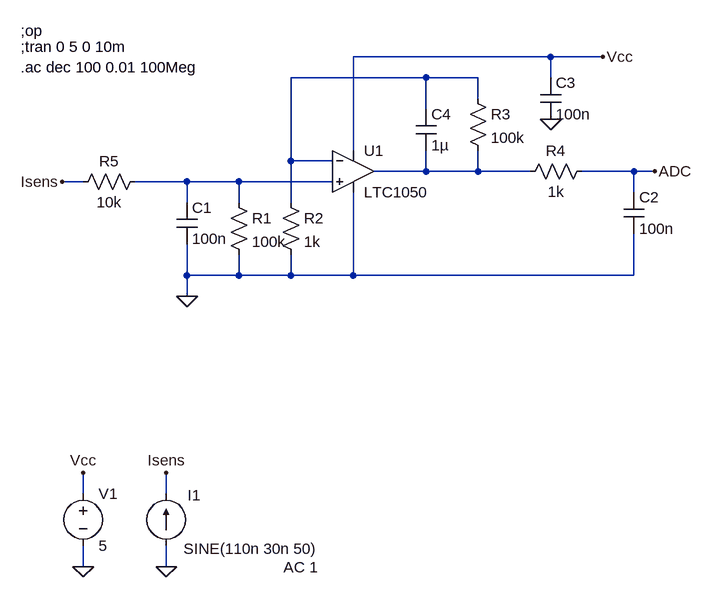
[diagram p0: schematic Ampli.asc]
Ampli.asc, the LTspice schematic file:
Version 4
SHEET 1 880 708
WIRE 464 -96 160 -96
WIRE 544 -96 464 -96
WIRE 272 -64 64 -64
WIRE 352 -64 272 -64
WIRE 464 -64 464 -96
WIRE 352 -32 352 -64
WIRE 272 -16 272 -64
WIRE 160 48 160 -96
WIRE 64 64 64 -64
WIRE 128 64 64 64
WIRE 272 80 272 48
WIRE 272 80 192 80
WIRE 352 80 352 48
WIRE 352 80 272 80
WIRE 432 80 352 80
WIRE 592 80 512 80
WIRE 624 80 592 80
WIRE -256 96 -288 96
WIRE -96 96 -176 96
WIRE -16 96 -96 96
WIRE 128 96 -16 96
WIRE 592 112 592 80
WIRE -96 128 -96 96
WIRE -16 128 -16 96
WIRE 64 128 64 64
WIRE -96 240 -96 192
WIRE -16 240 -16 208
WIRE -16 240 -96 240
WIRE 64 240 64 208
WIRE 64 240 -16 240
WIRE 160 240 160 112
WIRE 160 240 64 240
WIRE 592 240 592 176
WIRE 592 240 160 240
WIRE -96 272 -96 240
WIRE -256 576 -256 544
WIRE -128 576 -128 544
WIRE -256 688 -256 656
WIRE -128 688 -128 656
FLAG 464 0 0
FLAG -96 272 0
FLAG 544 -96 Vcc
FLAG 624 80 ADC
FLAG -288 96 Isens
FLAG -256 688 0
FLAG -128 688 0
FLAG -256 544 Vcc
FLAG -128 544 Isens
SYMBOL res -32 112 R0
SYMATTR InstName R1
SYMATTR Value 100k
SYMBOL res 48 112 R0
SYMATTR InstName R2
SYMATTR Value 1k
SYMBOL res 336 -48 R0
SYMATTR InstName R3
SYMATTR Value 100k
SYMBOL res -160 80 R90
WINDOW 0 0 56 VBottom 2
WINDOW 3 32 56 VTop 2
SYMATTR InstName R5
SYMATTR Value 10k
SYMBOL res 528 64 R90
WINDOW 0 0 56 VBottom 2
WINDOW 3 32 56 VTop 2
SYMATTR InstName R4
SYMATTR Value 1k
SYMBOL cap 448 -64 R0
SYMATTR InstName C3
SYMATTR Value 100n
SYMBOL cap 256 -16 R0
SYMATTR InstName C4
SYMATTR Value 1µ
SYMBOL cap 576 112 R0
SYMATTR InstName C2
SYMATTR Value 100n
SYMBOL OpAmps\\LTC1050 160 16 R0
SYMATTR InstName U1
SYMBOL cap -112 128 R0
SYMATTR InstName C1
SYMATTR Value 100n
SYMBOL voltage -256 560 R0
WINDOW 123 24 124 Left 2
WINDOW 39 0 0 Left 0
SYMATTR InstName V1
SYMATTR Value 5
SYMBOL current -128 656 R180
WINDOW 0 -53 78 Left 2
WINDOW 3 -234 -5 Left 2
WINDOW 123 -234 -33 Left 2
WINDOW 39 0 0 Left 0
SYMATTR InstName I1
SYMATTR Value SINE(110n 30n 50)
SYMATTR Value2 AC 1
TEXT -352 -112 Left 2 !;tran 0 5 0 10m
TEXT -352 -136 Left 2 !;op
TEXT -352 -80 Left 2 !.ac dec 100 0.01 100Meg

The netlist it stands for:
* Ampli.asc
R1 N003 0 100k
R2 N001 0 1k
R3 N001 N002 100k
R5 N003 Isens 10k
R4 ADC N002 1k
C3 Vcc 0 100n
C4 N001 N002 1µ
C2 ADC 0 100n
XU1 N003 N001 Vcc 0 N002 LTC1050  ; pins In+ In- V+ V- OUT
C1 N003 0 100n
V1 Vcc 0 5
I1 0 Isens SINE(110n 30n 50) AC 1
;tran 0 5 0 10m
;op
.ac dec 100 0.01 100Meg
.lib LTC.lib
.backanno
.end